# EAGLE design M401 (EAGLE 6.6.0)
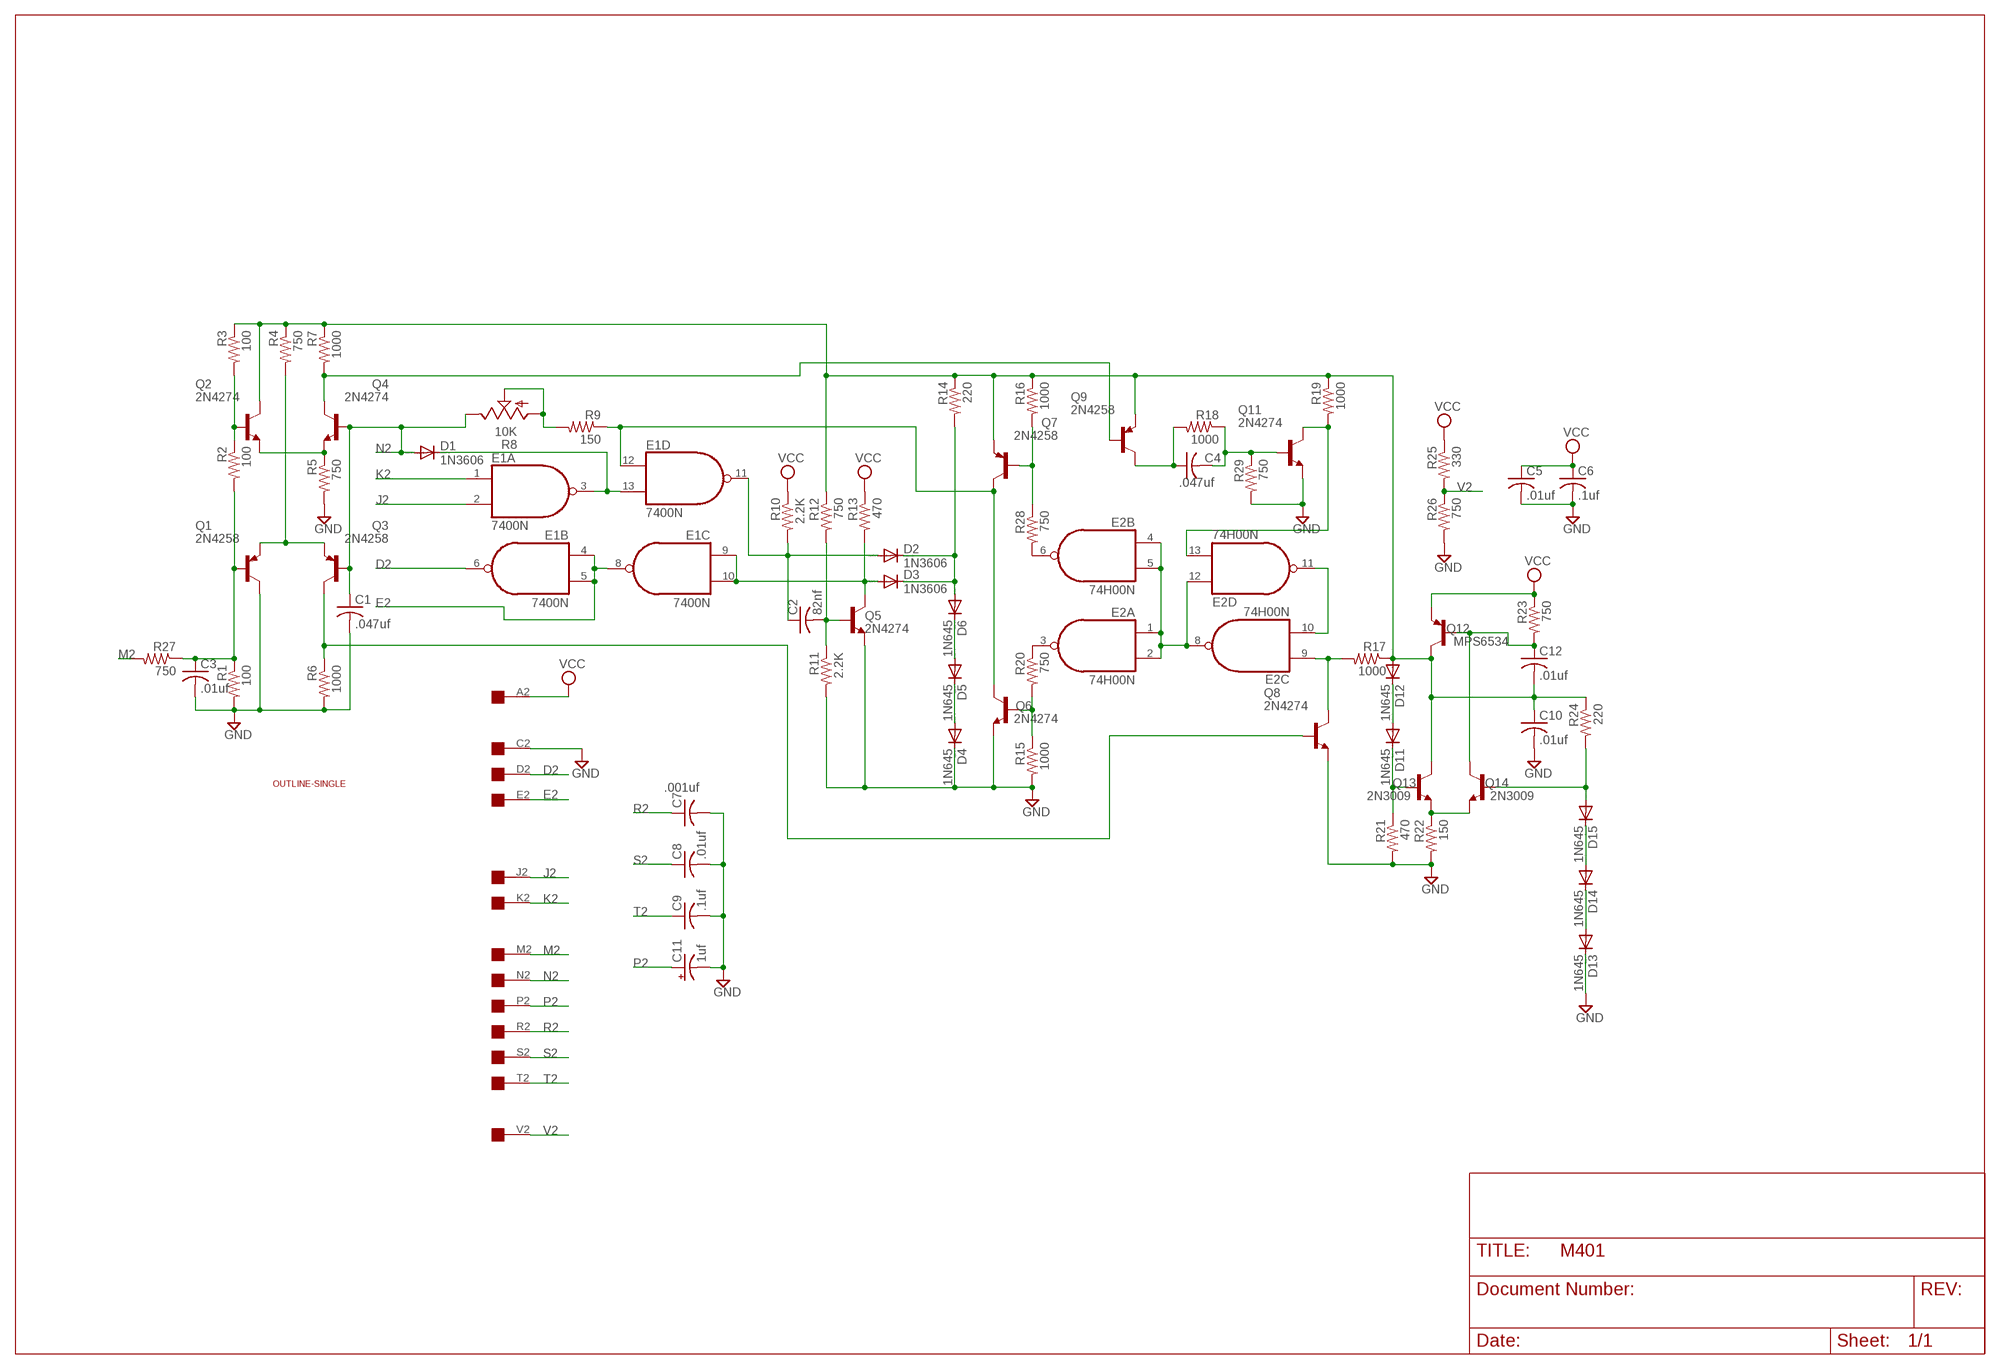
[diagram p0: schematic, sheet 1]

## Parts
C1  .047uf  C-US050-025X075  [C050-025X075]
C2  82nf  C-US050-025X075  [C050-025X075]
C3  .01uf  C-US050-025X075  [C050-025X075]
C4  .047uf  C-US050-025X075  [C050-025X075]
C5  .01uf  C-US050-025X075  [C050-025X075]
C6  .1uf  C-US050-025X075  [C050-025X075]
C7  .001uf  C-US050-025X075  [C050-025X075]
C8  .01uf  C-US050-025X075  [C050-025X075]
C9  .1uf  C-US050-025X075  [C050-025X075]
C10  .01uf  C-US050-025X075  [C050-025X075]
C11  1uf  CPOL-USE15-5AXIAL  [E15-5]
C12  .01uf  C-US050-025X075  [C050-025X075]
D1  1N3606  1N4148DO35-10  [DO35-10]
D2  1N3606  1N4148DO35-10  [DO35-10]
D3  1N3606  1N4148DO35-10  [DO35-10]
D4  1N645  1N4148DO35-10  [DO35-10]
D5  1N645  1N4148DO35-10  [DO35-10]
D6  1N645  1N4148DO35-10  [DO35-10]
D11  1N645  1N4148DO35-10  [DO35-10]
D12  1N645  1N4148DO35-10  [DO35-10]
D13  1N645  1N4148DO35-10  [DO35-10]
D14  1N645  1N4148DO35-10  [DO35-10]
D15  1N645  1N4148DO35-10  [DO35-10]
E1  7400N  [DIL14]
E2  74H00N  7400N  [DIL14]
Q1  2N4258  2N3637-PNP-TO39-EBC  [TO39]
Q2  2N4274  2N3019-NPN-TO39-EBC  [TO39]
Q3  2N4258  2N3637-PNP-TO39-EBC  [TO39]
Q4  2N4274  2N3019-NPN-TO39-EBC  [TO39]
Q5  2N4274  2N3019-NPN-TO39-EBC  [TO39]
Q6  2N4274  2N3019-NPN-TO39-EBC  [TO39]
Q7  2N4258  2N3637-PNP-TO39-EBC  [TO39]
Q8  2N4274  2N3019-NPN-TO39-EBC  [TO39]
Q9  2N4258  2N3637-PNP-TO39-EBC  [TO39]
Q11  2N4274  2N3019-NPN-TO39-EBC  [TO39]
Q12  MPS6534  2N3637-PNP-TO39-EBC  [TO39]
Q13  2N3009  2N3019-NPN-TO39-EBC  [TO39]
Q14  2N3009  2N3019-NPN-TO39-EBC  [TO39]
R1  100  R-US_0207/10  [0207/10]
R2  100  R-US_0207/10  [0207/10]
R3  100  R-US_0207/10  [0207/10]
R4  750  R-US_0207/10  [0207/10]
R5  750  R-US_0207/10  [0207/10]
R6  1000  R-US_0207/10  [0207/10]
R7  1000  R-US_0207/10  [0207/10]
R8  10K  TRIM_US-PTSPIN  [PT-SPIN]
R9  150  R-US_0207/10  [0207/10]
R10  2.2K  R-US_0207/10  [0207/10]
R11  2.2K  R-US_0207/10  [0207/10]
R12  750  R-US_0207/10  [0207/10]
R13  470  R-US_0207/10  [0207/10]
R14  220  R-US_0207/10  [0207/10]
R15  1000  R-US_0207/10  [0207/10]
R16  1000  R-US_0207/10  [0207/10]
R17  1000  R-US_0207/10  [0207/10]
R18  1000  R-US_0207/10  [0207/10]
R19  1000  R-US_0207/10  [0207/10]
R20  750  R-US_0207/10  [0207/10]
R21  470  R-US_0207/10  [0207/10]
R22  150  R-US_0207/10  [0207/10]
R23  750  R-US_0207/10  [0207/10]
R24  220  R-US_0207/10  [0207/10]
R25  330  R-US_0207/10  [0207/10]
R26  750  R-US_0207/10  [0207/10]
R27  750  R-US_0207/10  [0207/10]
R28  750  R-US_0207/10  [0207/10]
R29  750  R-US_0207/10  [0207/10]
U$1  OUTLINE-SINGLE  [SINGLE]
U$2  EDGE-1  [EDGE-CON1]

## Nets
D2: E1.6(B:O) U$2.D2
E2: E1.4(B:I0) E1.5(B:I1) E1.8(C:O) U$2.E2
GND [power]: C1.2 C3.2 C5.2 C6.2 C7.2 C8.2 C9.2 C10.2 C11.- D4.C D13.C Q1.3(C) Q5.1(E) Q6.1(E) Q8.1(E) Q11.1(E) R1.2 R5.2 R6.2 R11.2 R15.2 R21.2 R22.2 R26.2 R29.2 U$2.C2
J2: E1.2(A:I1) U$2.J2
K2: E1.1(A:I0) U$2.K2
M2: R27.2 U$2.M2
N2: C1.1 D1.A Q3.2(B) Q4.2(B) R8.E U$2.N2
N$1: D14.A D15.C
N$2: D13.A D14.C
N$3: D15.A Q14.2(B) R24.2
N$4: C12.1 Q12.2(B) Q14.3(C) R23.2
N$5: C10.1 C12.2 D12.A Q2.3(C) Q7.1(E) Q9.1(E) Q12.3(C) Q13.3(C) R3.1 R4.1 R7.1 R12.1 R14.1 R16.1 R17.1 R19.1 R24.1
N$6: D11.C Q13.2(B) R21.1
N$7 [power]: Q13.1(E) Q14.1(E) R22.1
N$8: D11.A D12.C
N$9: E2.1(A:I0) E2.2(A:I1) E2.4(B:I0) E2.5(B:I1) E2.8(C:O) E2.12(D:I0)
N$10: C3.1 Q1.2(B) R1.1 R2.2 R27.1
N$11: D3.A E1.9(C:I0) E1.10(C:I1) Q5.3(C) R13.2
N$12: D1.C E1.3(A:O) E1.13(D:I1)
N$13: D4.A D5.C
N$14: E2.10(C:I1) E2.11(D:O)
N$15: E2.9(C:I0) Q8.3(C) R17.2
N$16: E2.3(A:O) R20.1
N$17: E2.6(B:O) R28.2
N$18: Q7.2(B) R16.2 R28.1
N$19: Q6.2(B) R15.1 R20.2
N$20: D5.A D6.C
N$21: E1.12(D:I0) Q6.3(C) Q7.3(C) R9.1
N$22: C4.1 Q9.3(C) R18.2
N$23: C4.2 Q11.2(B) R18.1 R29.1
N$24: E2.13(D:I1) Q11.3(C) R19.2
N$25: D2.C D3.C D6.A R14.2
N$26: R8.A R8.S R9.2
N$28: C2.2 Q5.2(B) R11.1 R12.2
N$29: Q3.3(C) Q8.2(B) R6.1
N$30: C2.1 D2.A E1.11(D:O) R10.2
N$32: Q1.1(E) Q3.1(E) R4.2
N$33: Q4.3(C) Q9.2(B) R7.2
N$34: Q2.2(B) R2.1 R3.2
N$35: Q2.1(E) Q4.1(E) R5.1
P2: C11.+ U$2.P2
R2: C7.1 U$2.R2
S2: C8.1 U$2.S2
T2: C9.1 U$2.T2
V2: R25.2 R26.1 U$2.V2
VCC [power]: C5.1 C6.1 Q12.1(E) R10.1 R13.1 R23.1 R25.1 U$2.A2
Unconnected: U$2.B2 U$2.F2 U$2.H2 U$2.L2 U$2.U2

## Power pins joined to a net without a drawn wire
GND: E1.7(P:GND) E2.7(P:GND)
VCC: E1.14(P:VCC) E2.14(P:VCC)

## Library data of the parts
C1-C10 C12 = rcl:C-US: CAPACITOR, American symbol
C11 = rcl:CPOL-US: POLARIZED CAPACITOR, American symbol
D1-D6 D11-D15 = diode:1N4148: DIODE high speed (Philips)
E1 E2 = 74xx-us:74*00: Quad 2-input NAND gate
Q1 Q3 Q7 Q9 Q12 = transistor:*-PNP-: PNP Transistror
Q2 Q4-Q6 Q8 Q11 Q13 Q14 = transistor:*-NPN-: NPN Transistror BF959 corrected 2008.03.06
R1-R7 R9-R29 = rcl:R-US_: RESISTOR, American symbol
R8 = pot:TRIM_US-: POTENTIOMETER
U$1 = dec-con:OUTLINE-*: Board outlines for DEC boards.
U$2 = dec-con:EDGE-1: Single-Sided DEC Edge Connector -- (side 2)

## Net classes
1 power: width 0.508 mm, clearance 0.508 mm

## Board
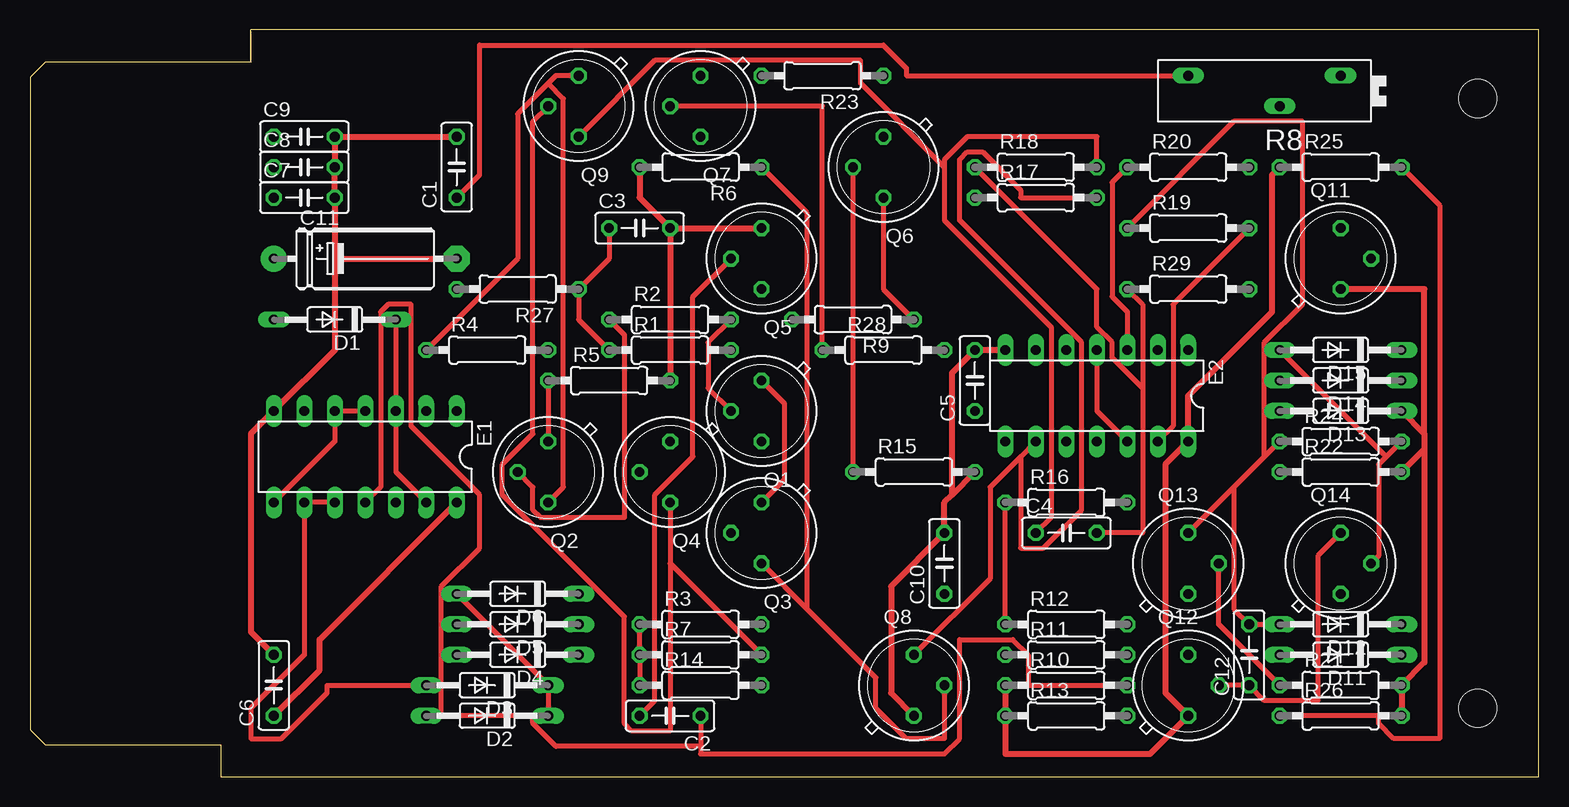
[diagram p1: board, top side]
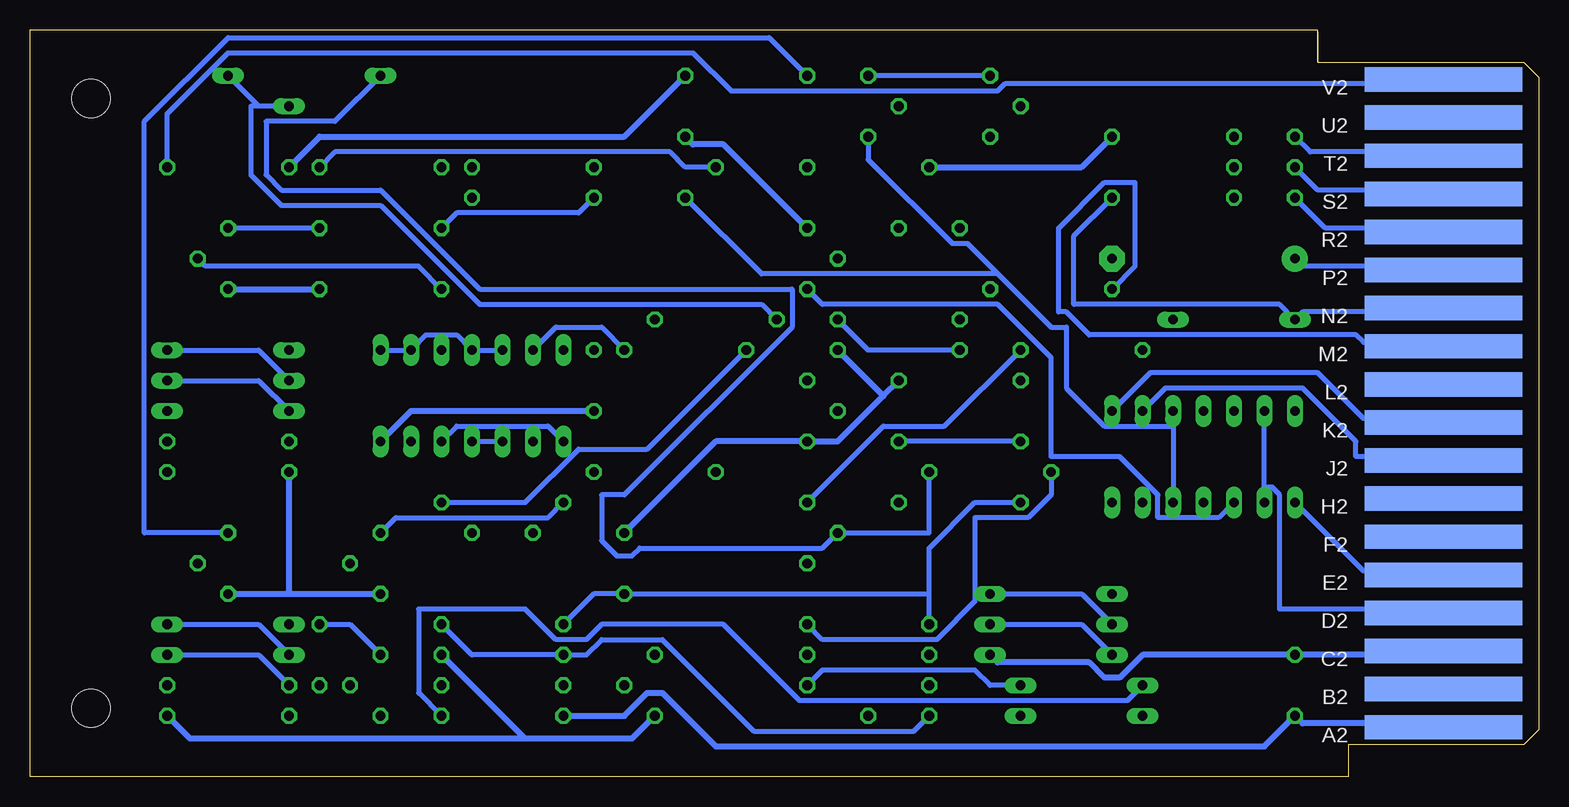
[diagram p2: board, bottom side, seen from below]

Size 125.73 x 62.23 mm. Coordinates in mm from the lower left corner, seen from the top.
Copper layers (1+16): Top 0.035mm / dielectric 1.5mm / Bottom 0.035mm
Design rules "16mils": minimum track width 16mil, minimum drill 32mil, track to track 15mil, track to pad 10mil, pad to pad 10mil, via to via 10mil, smd to smd 10mil, copper to edge 13mil, drill to drill 10mil, minimum pad ring 10mil, minimum via ring 8mil, stop-mask expansion 0mil, vias tented up to drill 0mil, thermal gap 10mil

### Footprints (pad centres in the part's own frame; a part is rotated, then mirrored left to right if it is on the bottom)
C050-025X075 = drill 0.813 octagon: 1 -2.54,0; 2 2.54,0
E15-5 = drill 0.813 pad 2.159: + -7.62,0 | drill 0.813 pad 2.159 octagon: - 7.62,0
DO35-10 = drill 0.813 long: A 5.08,0; C -5.08,0
DIL14 = drill 0.813 long: 1 -7.62,-3.81; 2 -5.08,-3.81; 3 -2.54,-3.81; 4 0,-3.81; 5 2.54,-3.81; 6 5.08,-3.81; 7 7.62,-3.81; 8 7.62,3.81; 9 5.08,3.81; 10 2.54,3.81; 11 0,3.81; 12 -2.54,3.81; 13 -5.08,3.81; 14 -7.62,3.81
TO39 = drill 0.813 octagon: 1 0,-2.54; 2 2.54,0; 3 0,2.54
0207/10 = drill 0.813 octagon: 1 -5.08,0; 2 5.08,0
PT-SPIN = drill 0.813 long: A -6.35,-1.27; E 6.35,-1.27; S -1.27,1.27
SINGLE = hole 3.175: 120.65,56.515; 120.65,5.715
EDGE-CON1 = smd 13.106 x 2.032 bottom: A2 7.938,4.128; B2 7.938,7.303; C2 7.938,10.477; D2 7.938,13.652; E2 7.938,16.828; F2 7.938,20.003; H2 7.938,23.177; J2 7.938,26.352; K2 7.938,29.527; L2 7.938,32.703; M2 7.938,35.877; N2 7.938,39.053; P2 7.938,42.227; R2 7.938,45.403; S2 7.938,48.578; T2 7.938,51.752; U2 7.938,54.928; V2 7.938,58.102

### Placement (x,y rotation side)
C1  35.56,50.8 90 top
C2  53.34,5.08 180 top
C3  50.8,45.72 0 top
C4  86.36,20.32 0 top
C5  78.74,33.02 90 top
C6  20.32,7.62 90 top
C7  22.86,48.26 0 top
C8  22.86,50.8 0 top
C9  22.86,53.34 0 top
C10  76.2,17.78 90 top
C11  27.94,43.18 0 top
C12  101.6,10.16 90 top
D1  25.4,38.1 180 top
D2  38.1,5.08 180 top
D3  38.1,7.62 180 top
D4  40.64,10.16 180 top
D5  40.64,12.7 180 top
D6  40.64,15.24 180 top
D11  109.22,10.16 180 top
D12  109.22,12.7 180 top
D13  109.22,30.48 180 top
D14  109.22,33.02 180 top
D15  109.22,35.56 180 top
E1  27.94,26.67 180 top
E2  88.9,31.75 180 top
Q1  60.96,30.48 180 top
Q2  43.18,25.4 180 top
Q3  60.96,20.32 180 top
Q4  53.34,25.4 180 top
Q5  60.96,43.18 180 top
Q6  71.12,50.8 180 top
Q7  55.88,55.88 180 top
Q8  73.66,7.62 0 top
Q9  45.72,55.88 180 top
Q11  109.22,43.18 0 top
Q12  96.52,7.62 0 top
Q13  96.52,17.78 0 top
Q14  109.22,17.78 0 top
R1  53.34,35.56 0 top
R2  53.34,38.1 0 top
R3  55.88,12.7 0 top
R4  38.1,35.56 0 top
R5  48.26,33.02 0 top
R6  55.88,50.8 180 top
R7  55.88,10.16 0 top
R8  102.87,57.15 180 top
R9  68.58,38.1 180 top
R10  86.36,7.62 0 top
R11  86.36,10.16 0 top
R12  86.36,12.7 0 top
R13  86.36,5.08 0 top
R14  55.88,7.62 0 top
R15  73.66,25.4 0 top
R16  86.36,22.86 0 top
R17  83.82,48.26 0 top
R18  83.82,50.8 0 top
R19  96.52,45.72 0 top
R20  96.52,50.8 0 top
R21  109.22,7.62 0 top
R22  109.22,25.4 0 top
R23  66.04,58.42 180 top
R24  109.22,27.94 0 top
R25  109.22,50.8 0 top
R26  109.22,5.08 0 top
R27  40.64,40.64 180 top
R28  71.12,35.56 0 top
R29  96.52,40.64 0 top
U$1  0,0 0 top
U$2  0,0 0 top

### Tracks (layer width: path | path; a pad name or v marks a point on that pad's centre or on a via)
D2
  Bottom 0.406: E1.6 22.86,24.13 22.23,24.13 21.59,23.5 21.59,13.97 8.26,13.97 U$2.D2
E2
  Top 0.406: E1.8 25.4,27.94 E1.5 E1.4
  Bottom 0.406: E1.8 14.61,17.14 8.26,17.14 U$2.E2
GND
  Top 0.508: R26.2 R21.2 116.21,9.53 116.21,27.3 | 116.21,27.3 R22.2 | 116.21,28.57 116.21,27.3 | D13.C 116.21,28.57 | Q11.1 116.21,40.64 116.21,28.57 | E2.7 C5.2 76.84,33.66 76.84,23.5 | Q8.1 71.76,6.99 71.76,15.88 C10.2 76.2,22.86 76.84,23.5 | 76.84,23.5 R15.2 | C1.2 C9.2 C8.2 C7.2 25.4,43.18 | 25.4,43.18 25.4,35.56 E1.7 18.42,28.57 18.42,12.06 C6.2 | 25.4,43.18 C11.- | C3.2 50.8,48.26 R6.2 | C3.2 Q5.1 | C3.2 R5.2
  Bottom 0.508: Q11.1 R29.2 | 84.46,3.17 R11.2 | 84.46,3.17 75.57,3.17 Q8.1 | R26.2 112.4,3.17 84.46,3.17 | U$2.C2 8.26,10.16 C6.2 33.02,10.16 34.93,8.26 36.2,8.26 37.47,9.53 45.09,9.53 D4.C | 54.61,31.75 58.42,27.94 Q1.3 68.58,27.94 C10.2 | 54.61,31.75 R5.2 | 54.61,31.75 R1.2 | Q6.1 70.49,52.7 67.95,52.7 Q5.1 | C1.2 38.1,50.8 R6.2
J2
  Bottom 0.406: E1.2 31.12,32.38 19.69,32.38 15.24,27.94 15.24,26.67 8.26,26.67 U$2.J2
K2
  Bottom 0.406: E1.1 32.39,33.66 18.42,33.66 14.61,29.84 8.26,29.84 U$2.K2
M2
  Bottom 0.406: R27.2 33.66,42.55 33.66,49.53 36.2,49.53 40.01,45.72 40.01,38.73 39.37,38.73 37.47,36.83 15.24,36.83 14.61,36.2 8.26,36.2 U$2.M2
N2
  Top 0.406: R8.E 73.03,58.42 73.03,59.05 71.12,60.96 37.47,60.96 37.47,50.16 C1.1
  Bottom 0.406: Q4.2 50.8,20.32 Q3.2 59.69,19.05 74.93,19.05 75.57,18.41 76.84,18.41 78.11,19.68 78.11,23.5 76.2,23.5 62.23,37.47 62.23,40.64 88.27,40.64 96.52,48.9 104.78,48.9 106.05,50.16 106.05,54.61 100.33,54.61 R8.E | U$2.N2 8.26,38.73 19.69,38.73 D1.A 21.59,39.37 38.74,39.37 38.74,45.09 C1.1
N$1
  Bottom 0.406: D14.A 106.68,35.56 D15.C
N$2
  Bottom 0.406: D13.A 106.68,33.02 D14.C
N$3
  Top 0.406: Q14.2 112.4,18.41 112.4,26.04 113.03,26.67 | R24.2 113.03,26.67 | 113.03,26.67 D15.A
N$4
  Top 0.406: Q12.2 C12.1 102.87,6.35 107.32,6.35 107.32,18.41 Q14.3
  Bottom 0.406: R23.2 64.14,61.59 109.22,61.59 116.21,54.61 116.21,20.32 Q14.3
N$5
  Top 0.406: R4.1 40.64,43.18 40.64,55.24 43.18,57.78 | 43.18,57.78 43.82,58.42 Q9.1 | R14.1 R7.1 R3.1 | R12.1 R16.1 | D12.A C12.2 100.33,13.97 100.33,24.13 | R24.1 102.87,26.67 | 102.87,26.67 100.33,24.13 | 100.33,24.13 Q13.3 | R19.1 100.33,54.61 106.05,54.61 106.05,39.37 102.87,36.2 102.87,26.67 | 43.18,57.78 44.45,56.52 44.45,24.13 Q2.3
  Bottom 0.406: Q9.1 Q7.1 | Q2.3 46.99,22.86 50.8,19.05 50.8,15.24 | R3.1 50.8,15.24 | R19.1 90.17,46.99 80.01,46.99 R17.1 | R12.1 78.74,15.24 C10.1 50.8,15.24 | Q12.3 99.06,12.7 C12.2 | R16.1 82.55,21.59 95.25,21.59 Q13.3
N$6
  Top 0.406: Q13.2 99.06,12.7 R21.1
  Bottom 0.406: R21.1 106.68,10.16 D11.C
N$7
  Bottom 0.508: Q14.1 104.14,15.24 | 104.14,15.24 Q13.1 | 104.14,15.24 R22.1
N$8
  Bottom 0.406: D11.A 106.68,12.7 D12.C
N$9
  Top 0.406: E2.12 88.9,30.48 E2.4
  Bottom 0.406: E2.8 82.55,29.21 90.17,29.21 E2.12 | E2.5 E2.4 90.17,36.83 92.71,36.83 E2.2 E2.1
N$10
  Top 0.406: Q1.2 56.52,32.38 56.52,36.2 R2.2 | C3.1 48.26,43.18 R27.1 45.72,38.1 R1.1
  Bottom 0.406: R2.2 55.88,35.56 R1.1
N$11
  Top 0.406: E1.10 E1.9 22.86,10.16 18.42,5.71 18.42,3.17 20.96,3.17 24.77,6.99 24.77,7.62 D3.A
  Bottom 0.406: R13.2 93.35,6.99 93.35,13.97 84.46,13.97 81.92,11.43 79.38,11.43 78.11,12.7 67.95,12.7 61.6,6.35 34.29,6.35 D3.A | Q5.3 59.69,39.37 45.09,39.37 40.64,34.92 40.64,26.67 34.93,26.67 31.75,23.5 31.75,21.59 26.67,21.59 E1.10
N$12
  Top 0.406: D1.C E1.3 30.48,25.4 E1.13
N$13
  Bottom 0.406: D4.A 38.1,12.7 D5.C
N$14
  Bottom 0.406: E2.11 E2.10
N$15
  Top 0.406: Q8.3 80.01,16.51 80.01,24.13 82.55,26.67 | E2.9 82.55,26.67 | R17.2 82.55,48.26 82.55,48.9 79.38,52.07 78.11,52.07 77.47,51.44 77.47,46.35 87.63,36.2 87.63,22.23 84.46,19.05 82.55,19.05 82.55,26.67
N$16
  Top 0.406: E2.3 91.44,38.73 90.17,40.01 90.17,49.53 R20.1
N$17
  Bottom 0.406: R28.2 78.11,37.47 81.92,37.47 E2.6
N$18
  Top 0.406: Q7.2 66.04,55.88 R28.1
  Bottom 0.406: R28.1 74.3,27.3 80.01,27.3 84.46,22.86 R16.2
N$19
  Top 0.406: Q6.2 R15.1
  Bottom 0.406: R20.2 100.33,52.07 72.39,52.07 71.12,50.8 Q6.2
N$20
  Bottom 0.406: D5.A 38.1,15.24 D6.C
N$21
  Top 0.406: R9.1 71.12,40.64 Q6.3
  Bottom 0.406: E1.12 30.48,29.21 36.2,29.21 39.37,32.38 39.37,37.47 40.64,37.47 45.09,41.91 | 45.09,41.91 47.63,44.45 48.9,44.45 55.88,51.44 Q7.3 | Q6.3 64.77,41.91 45.09,41.91
N$22
  Top 0.406: C4.1 85.09,21.59 85.09,37.47 76.2,46.35 76.2,50.8 | 76.2,50.8 76.2,51.44 78.11,53.34 88.9,53.34 R18.2 | Q9.3 52.07,59.69 69.22,59.69 69.22,57.78 76.2,50.8
N$23
  Top 0.406: C4.2 92.71,20.32 92.71,32.38 | 92.71,32.38 92.71,39.37 R29.1 | R18.1 88.9,40.64 88.9,37.47 90.17,36.2 90.17,34.92 92.71,32.38
  Bottom 0.406: Q11.2 111.13,42.55 93.35,42.55 R29.1
N$24
  Top 0.406: E2.13 95.25,29.21 95.25,39.37 R19.2
  Bottom 0.406: R19.2 Q11.3
N$25
  Top 0.406: D2.C D3.C D6.A
  Bottom 0.406: R14.2 59.69,8.89 46.99,8.89 45.72,7.62 D3.C
N$26
  Bottom 0.406: R9.2 64.77,39.37 88.27,39.37 96.52,47.62 104.78,47.62 107.32,50.16 107.32,55.88 106.68,55.88 | R8.S 106.68,55.88 | 106.68,55.88 R8.A
N$28
  Top 0.406: Q5.2 55.25,40.01 55.25,26.67 52.07,23.5 52.07,6.35 C2.2
  Bottom 0.406: C2.2 52.07,3.81 65.41,3.81 73.03,11.43 78.11,11.43 79.38,10.16 R11.1 88.9,10.16 R12.2
N$29
  Top 0.406: 64.77,13.97 70.49,8.26 70.49,5.71 73.03,3.17 76.2,3.17 Q8.2 | 64.77,13.97 Q3.3 | R6.1 64.77,46.99 64.77,13.97
N$30
  Top 0.406: 34.29,5.08 41.91,5.08 41.91,4.45 43.82,2.54 55.88,2.54 | 34.29,5.08 D2.A | C2.1 55.88,2.54 | E1.11 29.21,24.13 29.21,38.73 29.85,39.37 31.75,39.37 31.75,29.21 37.47,23.5 37.47,19.05 34.29,15.88 34.29,5.08 | R10.2 83.19,7.62 83.19,10.16 81.92,11.43 77.47,11.43 77.47,3.17 76.2,1.91 55.88,1.91 55.88,2.54
N$32
  Top 0.406: Q3.1 62.87,24.77 62.87,31.11 Q1.1
  Bottom 0.406: R4.2 49.53,29.21 54.61,29.21 Q3.1
N$33
  Top 0.406: 53.34,17.78 R7.2 | Q4.3 53.34,17.78 | Q9.2 41.91,54.61 41.91,28.57 39.37,26.04 39.37,23.5 49.53,13.34 49.53,4.45 50.17,3.81 53.34,3.81 53.34,17.78
N$34
  Top 0.406: Q2.2 41.91,24.13 41.91,22.23 42.55,21.59 49.53,21.59 49.53,36.83 R2.1
  Bottom 0.406: R3.2 59.69,11.43 50.17,11.43 46.99,14.61 46.99,21.59 42.55,21.59 40.64,23.5 Q2.2
N$35
  Top 0.406: R5.1 Q2.1
  Bottom 0.406: Q2.1 Q4.1
P2
  Bottom 0.406: C11.+ 19.69,42.55 8.26,42.55 U$2.P2
R2
  Bottom 0.406: C7.1 17.78,45.72 8.26,45.72 U$2.R2
S2
  Bottom 0.406: C8.1 18.42,48.9 8.26,48.9 U$2.S2
T2
  Bottom 0.406: C9.1 19.05,52.07 8.26,52.07 U$2.T2
V2
  Top 0.406: R26.1 112.4,5.08 112.4,4.45 113.67,3.17 117.48,3.17 117.48,47.62 R25.2
  Bottom 0.406: R25.2 114.3,55.24 109.22,60.33 70.49,60.33 67.31,57.15 45.09,57.15 44.45,57.78 8.26,57.78 U$2.V2
VCC
  Top 0.508: E1.14 24.13,11.43 24.13,8.89 C6.1 | R10.1 R13.1 81.28,1.91 93.35,1.91 Q12.1 94.62,6.99 94.62,26.04 E2.14 96.52,31.75 103.51,38.73 103.51,50.16 R25.1
  Bottom 0.508: U$2.A2 8.26,4.45 19.69,4.45 C6.1 22.86,2.54 68.58,2.54 73.03,6.99 74.3,6.99 76.2,5.08 R13.1 | C5.1 93.98,30.48 E2.14 | R23.1 76.2,53.34 101.6,53.34 R25.1